# Altium project NetworkModule.PrjPcb
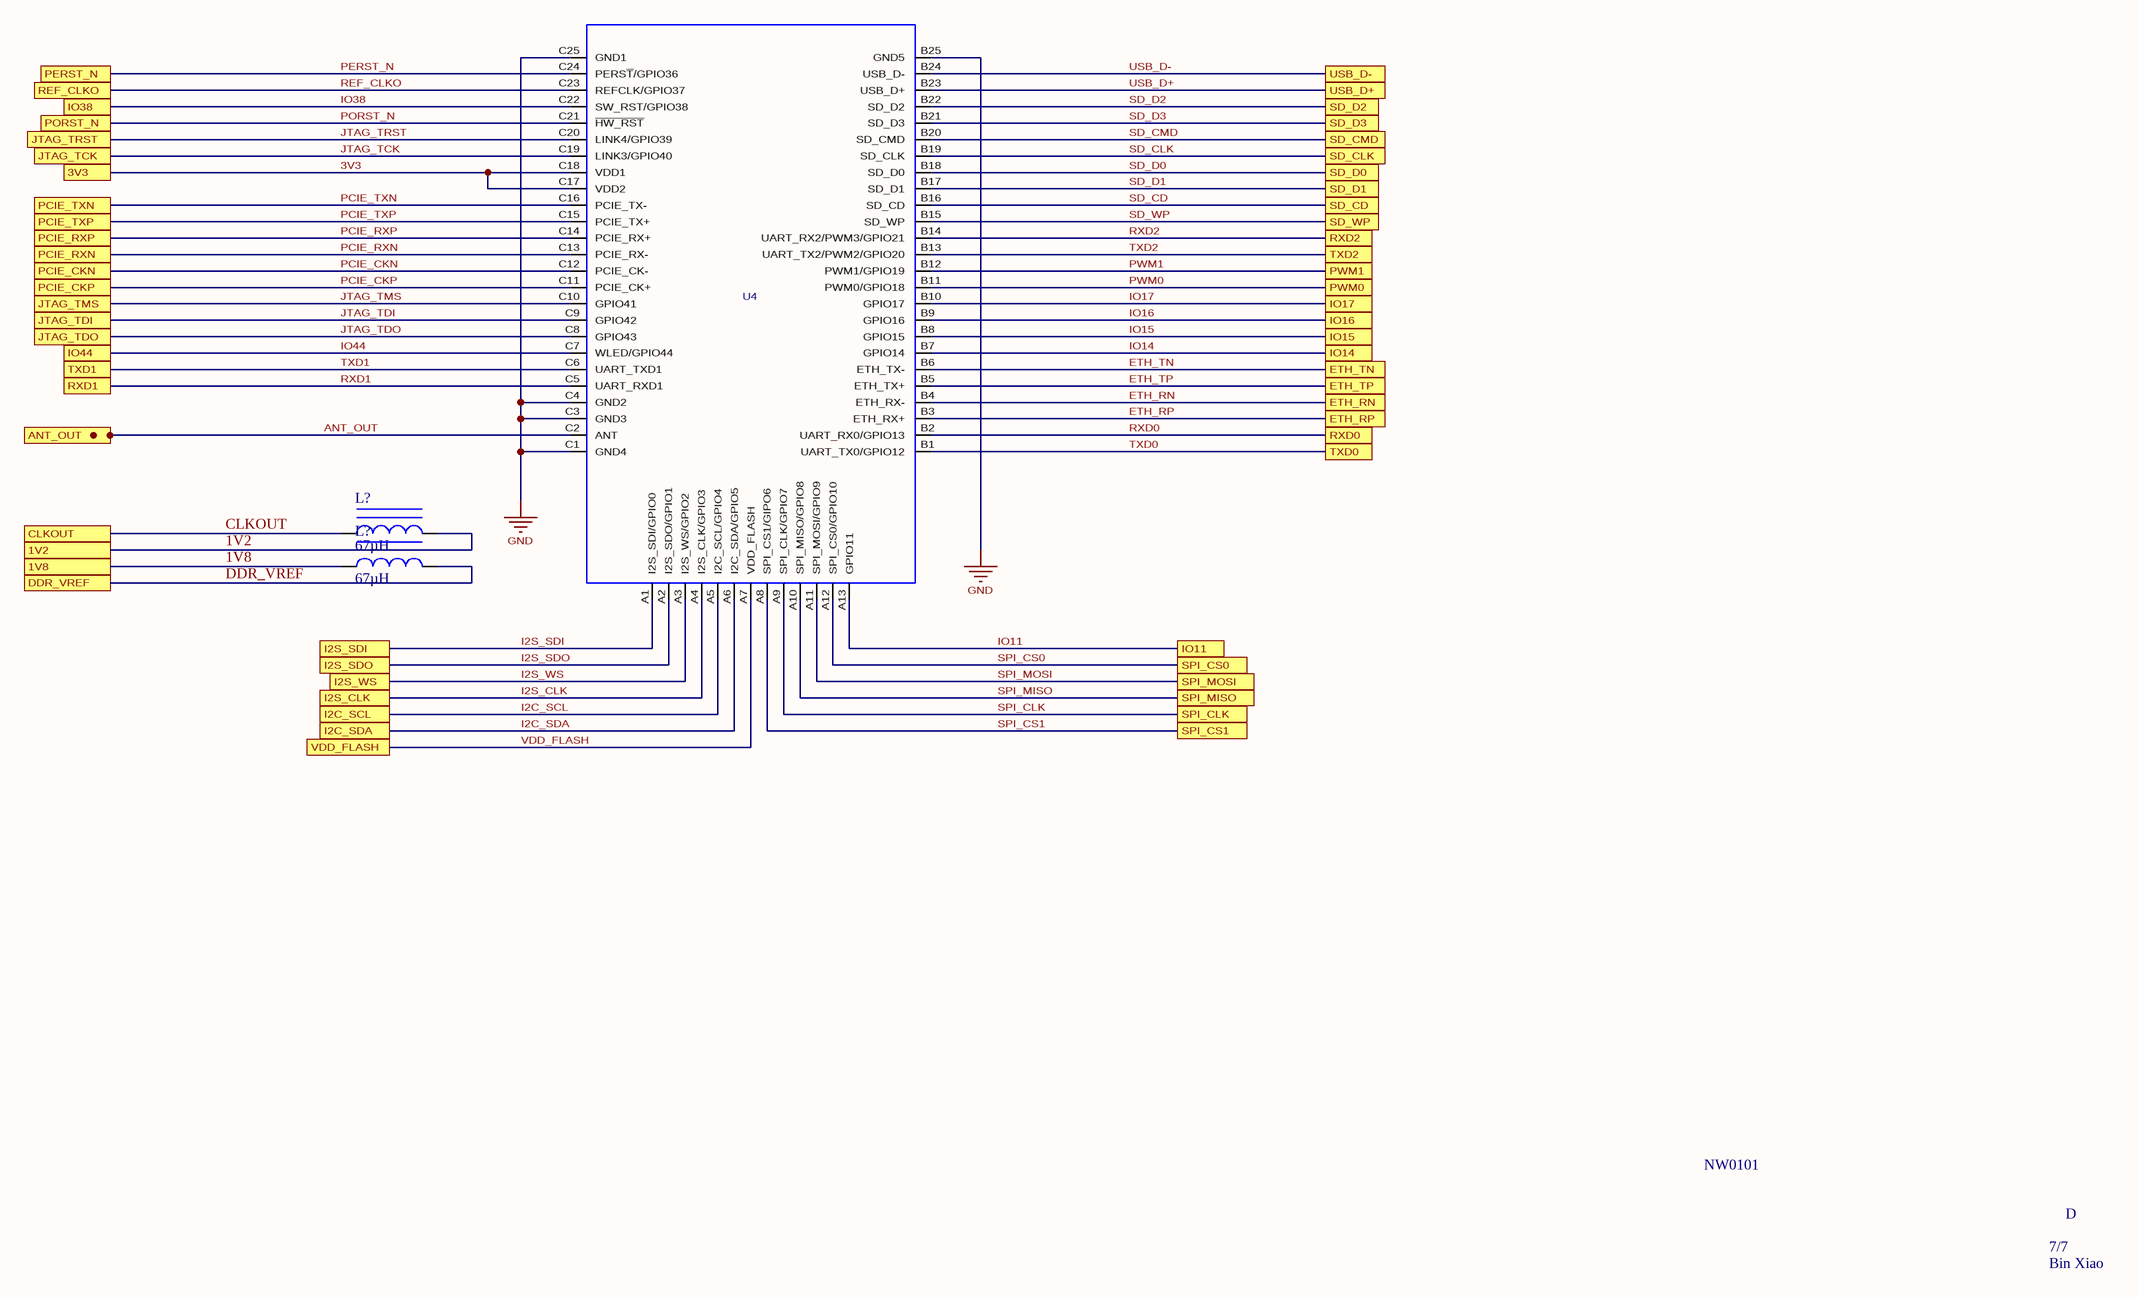
[diagram p0: INTERFACE.SchDoc]
1 sheet, 3 parts. Net scope: flat (ports and power ports of the same name join across sheets).
Board file: PCB-NW0101 Adaptor Rev.A.PcbDoc

## Sheet INTERFACE.SchDoc: Network Module
size 431 x 279 mm; DrawnBy: Bin Xiao; Organization: RYSE Inc.

### Parts
(Parts that share a designator on the sheet are numbered #1, #2 ... from top to bottom, then left to right.)
L?#1  Inductance: 67µH  [PULS-PE-92108KNL-KM4-2]  (hidden comment: PE-92108KNL)
L?#2  Inductance: 67µH  [PULS-PE-92108KNL-KM4-2]  (hidden comment: PE-92108KNL)
U4  OMEGA2S-PCB  [OMEGA2S+PCB]  (value not drawn)

### Ports
1V2, 1V8, 3V3, ANT_OUT, CLKOUT, DDR_VREF, ETH_RN, ETH_RP, ETH_TN, ETH_TP, I2C_SCL, I2C_SDA, I2S_CLK, I2S_SDI, I2S_SDO, I2S_WS, IO11, IO14, IO15, IO16, IO17, IO38, IO44, JTAG_TCK, JTAG_TDI, JTAG_TDO, JTAG_TMS, JTAG_TRST, PCIE_CKN, PCIE_CKP, PCIE_RXN, PCIE_RXP, PCIE_TXN, PCIE_TXP, PERST_N, PORST_N, PWM0, PWM1, REF_CLKO, RXD0, RXD1, RXD2, SD_CD, SD_CLK, SD_CMD, SD_D0, SD_D1, SD_D2, SD_D3, SD_WP, SPI_CLK, SPI_CS0, SPI_CS1, SPI_MISO, SPI_MOSI, TXD0, TXD1, TXD2, USB_D+, USB_D-, VDD_FLASH

### Nets
GND: U4.B25(GND5) U4.C1(GND4) U4.C3(GND3) U4.C4(GND2) U4.C25(GND1)
1V2: L?#1.2 ; port 1V2
1V8: L?#2.1 ; port 1V8
3V3: U4.C17(VDD2) U4.C18(VDD1) ; port 3V3
ANT_OUT: U4.C2(ANT) ; port ANT_OUT
CLKOUT: L?#1.1 ; port CLKOUT
DDR_VREF: L?#2.2 ; port DDR_VREF
ETH_RN: U4.B4(ETH_RX-) ; port ETH_RN
ETH_RP: U4.B3(ETH_RX+) ; port ETH_RP
ETH_TN: U4.B6(ETH_TX-) ; port ETH_TN
ETH_TP: U4.B5(ETH_TX+) ; port ETH_TP
I2C_SCL: U4.A5(I2C_SCL/GPIO4) ; port I2C_SCL
I2C_SDA: U4.A6(I2C_SDA/GPIO5) ; port I2C_SDA
I2S_CLK: U4.A4(I2S_CLK/GPIO3) ; port I2S_CLK
I2S_SDI: U4.A1(I2S_SDI/GPIO0) ; port I2S_SDI
I2S_SDO: U4.A2(I2S_SDO/GPIO1) ; port I2S_SDO
I2S_WS: U4.A3(I2S_WS/GPIO2) ; port I2S_WS
IO11: U4.A13(GPIO11) ; port IO11
IO14: U4.B7(GPIO14) ; port IO14
IO15: U4.B8(GPIO15) ; port IO15
IO16: U4.B9(GPIO16) ; port IO16
IO17: U4.B10(GPIO17) ; port IO17
IO38: U4.C22(SW_RST/GPIO38) ; port IO38
IO44: U4.C7(WLED/GPIO44) ; port IO44
JTAG_TCK: U4.C19(LINK3/GPIO40) ; port JTAG_TCK
JTAG_TDI: U4.C9(GPIO42) ; port JTAG_TDI
JTAG_TDO: U4.C8(GPIO43) ; port JTAG_TDO
JTAG_TMS: U4.C10(GPIO41) ; port JTAG_TMS
JTAG_TRST: U4.C20(LINK4/GPIO39) ; port JTAG_TRST
PCIE_CKN: U4.C12(PCIE_CK-) ; port PCIE_CKN
PCIE_CKP: U4.C11(PCIE_CK+) ; port PCIE_CKP
PCIE_RXN: U4.C13(PCIE_RX-) ; port PCIE_RXN
PCIE_RXP: U4.C14(PCIE_RX+) ; port PCIE_RXP
PCIE_TXN: U4.C16(PCIE_TX-) ; port PCIE_TXN
PCIE_TXP: U4.C15(PCIE_TX+) ; port PCIE_TXP
PERST_N: U4.C24(PERS~{T}/GPIO36) ; port PERST_N
PORST_N: U4.C21(~{HW_RST}) ; port PORST_N
PWM0: U4.B11(PWM0/GPIO18) ; port PWM0
PWM1: U4.B12(PWM1/GPIO19) ; port PWM1
REF_CLKO: U4.C23(REFCLK/GPIO37) ; port REF_CLKO
RXD0: U4.B2(UART_RX0/GPIO13) ; port RXD0
RXD1: U4.C5(UART_RXD1) ; port RXD1
RXD2: U4.B14(UART_RX2/PWM3/GPIO21) ; port RXD2
SD_CD: U4.B16(SD_CD) ; port SD_CD
SD_CLK: U4.B19(SD_CLK) ; port SD_CLK
SD_CMD: U4.B20(SD_CMD) ; port SD_CMD
SD_D0: U4.B18(SD_D0) ; port SD_D0
SD_D1: U4.B17(SD_D1) ; port SD_D1
SD_D2: U4.B22(SD_D2) ; port SD_D2
SD_D3: U4.B21(SD_D3) ; port SD_D3
SD_WP: U4.B15(SD_WP) ; port SD_WP
SPI_CLK: U4.A9(SPI_CLK/GPIO7) ; port SPI_CLK
SPI_CS0: U4.A12(SPI_CS0/GPIO10) ; port SPI_CS0
SPI_CS1: U4.A8(SPI_CS1/GIPO6) ; port SPI_CS1
SPI_MISO: U4.A10(SPI_MISO/GPIO8) ; port SPI_MISO
SPI_MOSI: U4.A11(SPI_MOSI/GPIO9) ; port SPI_MOSI
TXD0: U4.B1(UART_TX0/GPIO12) ; port TXD0
TXD1: U4.C6(UART_TXD1) ; port TXD1
TXD2: U4.B13(UART_TX2/PWM2/GPIO20) ; port TXD2
USB_D+: U4.B23(USB_D+) ; port USB_D+
USB_D-: U4.B24(USB_D-) ; port USB_D-
VDD_FLASH: U4.A7(VDD_FLASH) ; port VDD_FLASH

### Notes on the sheet
- NW0101
- 7/7
- D
- Bin Xiao

### Library data of the parts
L?#1 L?#2 = CMP-006-00011-3: THT Power Inductor, 67 uH, 0.045 Ohm, -40 to 130 degC, 2-Pin THD (KM4), RoHS, Tray; Manufacturer: Pulse Electronics; Current Rating: 3.6A; Tolerance: 20%; Shielding: Unshielded; Mounting Technology: TH; Lead Pitch: 11.44mm; Min Operating Temperature: -40°C; RoHS Compliant: True; Package Quantity: 55; Packaging: Tray; Datasheet Version: Feb-15; Max Operating Temperature: 130°C; Package Description: 2-Pin Through Hole Device, Body 24.14 x 15.5 mm; Inductance Tolerance: 20%; Datasheet URL: http://productfinder.pulseeng.com/products/datasheets/P635.pdf; Case/Package: Radial; Resistance: 0.045Ohm; Package Reference: PE-92108KNL-KM4-2
U4 = OMEGA2S-PCB: RX TXRX MODULE WIFI U.FL SMD; Manufacturer: Onion Corporation; Part Number: OM-O2S; Geometry.Height: 0mm; Prefered Vender: Digikey; Type: Electronic OEM Component; Revision: A; PCB DECAL: OMEGA2S+PCB